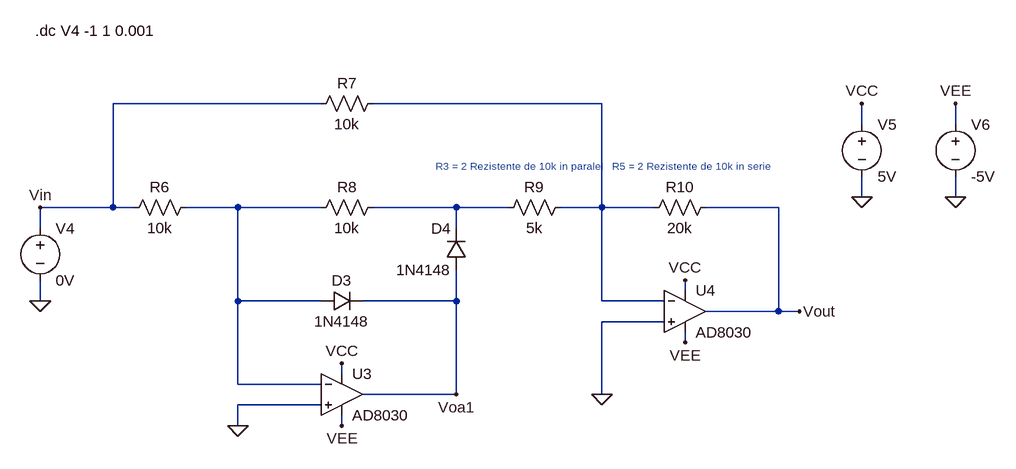
[diagram p0: schematic Etaj 4 - Dc sweep castig = specs.asc]
Etaj 4 - Dc sweep castig = specs.asc, the LTspice schematic file:
Version 4.1
SHEET 1 1540 1144
WIRE 480 560 160 560
WIRE 912 560 560 560
WIRE 1312 592 1312 560
WIRE 1456 592 1456 560
WIRE 1312 704 1312 672
WIRE 1456 704 1456 672
WIRE 160 720 160 560
WIRE 160 720 48 720
WIRE 192 720 160 720
WIRE 352 720 272 720
WIRE 480 720 352 720
WIRE 688 720 560 720
WIRE 768 720 688 720
WIRE 912 720 912 560
WIRE 912 720 848 720
WIRE 992 720 912 720
WIRE 1184 720 1072 720
WIRE 48 752 48 720
WIRE 688 752 688 720
WIRE 1040 848 1040 832
WIRE 48 864 48 832
WIRE 352 864 352 720
WIRE 480 864 352 864
WIRE 688 864 688 816
WIRE 688 864 544 864
WIRE 912 864 912 720
WIRE 1008 864 912 864
WIRE 1184 880 1184 720
WIRE 1184 880 1072 880
WIRE 1216 880 1184 880
WIRE 1008 896 912 896
WIRE 1040 928 1040 912
WIRE 512 976 512 960
WIRE 352 992 352 864
WIRE 480 992 352 992
WIRE 688 1008 688 864
WIRE 688 1008 544 1008
WIRE 912 1008 912 896
WIRE 480 1024 352 1024
WIRE 352 1056 352 1024
WIRE 512 1056 512 1040
FLAG 352 1056 0
FLAG 48 864 0
FLAG 912 1008 0
FLAG 1312 704 0
FLAG 1456 704 0
FLAG 1312 560 VCC
FLAG 1456 560 VEE
FLAG 1040 832 VCC
FLAG 512 960 VCC
FLAG 1040 928 VEE
FLAG 512 1056 VEE
FLAG 1216 880 Vout
FLAG 48 720 Vin
FLAG 688 1008 Voa1
SYMBOL voltage 48 736 R0
WINDOW 123 0 0 Left 0
WINDOW 39 0 0 Left 0
SYMATTR InstName V4
SYMATTR Value 0V
SYMBOL res 288 704 R90
WINDOW 0 0 56 VBottom 2
WINDOW 3 32 56 VTop 2
SYMATTR InstName R6
SYMATTR Value 10k
SYMBOL res 576 544 R90
WINDOW 0 0 56 VBottom 2
WINDOW 3 32 56 VTop 2
SYMATTR InstName R7
SYMATTR Value 10k
SYMBOL res 576 704 R90
WINDOW 0 0 56 VBottom 2
WINDOW 3 32 56 VTop 2
SYMATTR InstName R8
SYMATTR Value 10k
SYMBOL diode 480 880 R270
WINDOW 0 32 32 VTop 2
WINDOW 3 0 32 VBottom 2
SYMATTR InstName D3
SYMATTR Value 1N4148
SYMBOL diode 704 816 R180
WINDOW 0 24 64 Left 2
WINDOW 3 24 0 Left 2
SYMATTR InstName D4
SYMATTR Value 1N4148
SYMBOL res 864 704 R90
WINDOW 0 0 56 VBottom 2
WINDOW 3 32 56 VTop 2
SYMATTR InstName R9
SYMATTR Value 5k
SYMBOL OpAmps\\AD8030 512 944 R0
SYMATTR InstName U3
SYMBOL res 1088 704 R90
WINDOW 0 0 56 VBottom 2
WINDOW 3 32 56 VTop 2
SYMATTR InstName R10
SYMATTR Value 20k
SYMBOL OpAmps\\AD8030 1040 816 R0
SYMATTR InstName U4
SYMBOL voltage 1312 576 R0
WINDOW 123 0 0 Left 0
WINDOW 39 0 0 Left 0
SYMATTR InstName V5
SYMATTR Value 5V
SYMBOL voltage 1456 576 R0
WINDOW 123 0 0 Left 0
WINDOW 39 0 0 Left 0
SYMATTR InstName V6
SYMATTR Value -5V
TEXT 928 656 Left 1 ;R5 = 2 Rezistente de 10k in serie
TEXT 656 656 Left 1 ;R3 = 2 Rezistente de 10k in paralel
TEXT 40 448 Left 2 !.dc V4 -1 1 0.001

The netlist it stands for:
* Etaj 4 - Dc sweep castig = specs.asc
V4 Vin 0 0V
R6 N002 Vin 10k
R7 N001 Vin 10k
R8 N003 N002 10k
D3 N002 Voa1 1N4148
D4 Voa1 N003 1N4148
R9 N001 N003 5k
X§U3 0 N002 VCC VEE Voa1 AD8040  ; AD8030, pins In+ In- V+ V- OUT
R10 Vout N001 20k
X§U4 0 N001 VCC VEE Vout AD8040  ; AD8030, pins In+ In- V+ V- OUT
V5 VCC 0 5V
V6 VEE 0 -5V
.model D D
.lib standard.dio
* R5 = 2 Rezistente de 10k in serie
* R3 = 2 Rezistente de 10k in paralel
.dc V4 -1 1 0.001
.lib ADI.lib
.backanno
.end

* Results of the author's LTspice run, read from the files saved beside the schematic
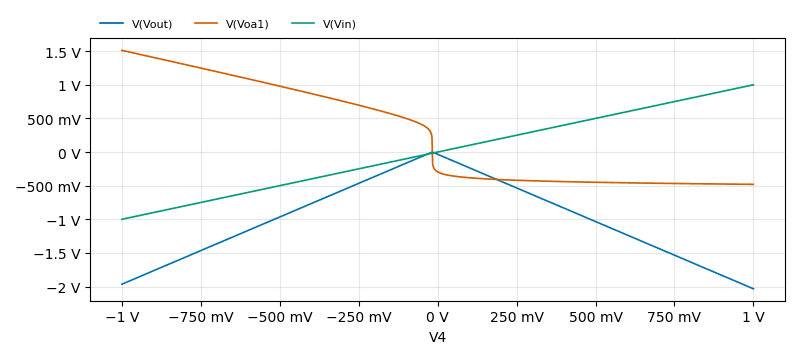
[diagram p1: DC transfer characteristic of Etaj 4 - Dc sweep castig = specs.asc, plotted from the saved traces]
* DC transfer characteristic, 1 run:
*   V(Vout): -1.965 V at V4=-1 V, -2.034 V at V4=1 V, min -2.034 V, max -5.131 nV
*   V(Voa1): 1.512 V at V4=-1 V, -480.6 mV at V4=1 V, min -480.6 mV, max 1.512 V
*   V(Vin): -1 V at V4=-1 V, 1 V at V4=1 V, min -1 V, max 1 V